# EAGLE design EXT1 (EAGLE 6.4)
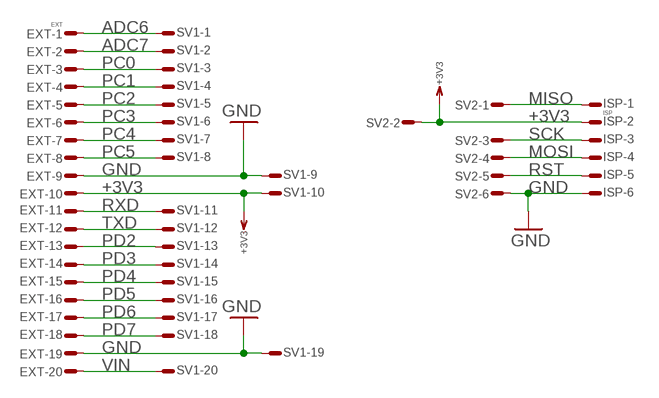
[diagram p0: schematic, sheet 1]

## Parts
EXT  EXT  ML20SE  [ML20S]
ISP  ISP  ML6ES  [ML6S]
SV1  ML20LE  [ML20L]
SV2  ML6EM  [ML6]

## Nets
+3V3: EXT.10 ISP.2 SV1.10 SV2.2
ADC6: EXT.1 SV1.1
ADC7: EXT.2 SV1.2
GND: EXT.9 EXT.19 ISP.6 SV1.9 SV1.19 SV2.6
MISO: ISP.1 SV2.1
MOSI: ISP.4 SV2.4
PC0: EXT.3 SV1.3
PC1: EXT.4 SV1.4
PC2: EXT.5 SV1.5
PC3: EXT.6 SV1.6
PC4: EXT.7 SV1.7
PC5: EXT.8 SV1.8
PD2: EXT.13 SV1.13
PD3: EXT.14 SV1.14
PD4: EXT.15 SV1.15
PD5: EXT.16 SV1.16
PD6: EXT.17 SV1.17
PD7: EXT.18 SV1.18
RST: ISP.5 SV2.5
RXD: EXT.11 SV1.11
SCK: ISP.3 SV2.3
TXD: EXT.12 SV1.12
VIN: EXT.20 SV1.20

## Library data of the parts
EXT SV1 = Conn:ML20?E: HARTING
ISP SV2 = Conn:ML6E: HARTING

## Board
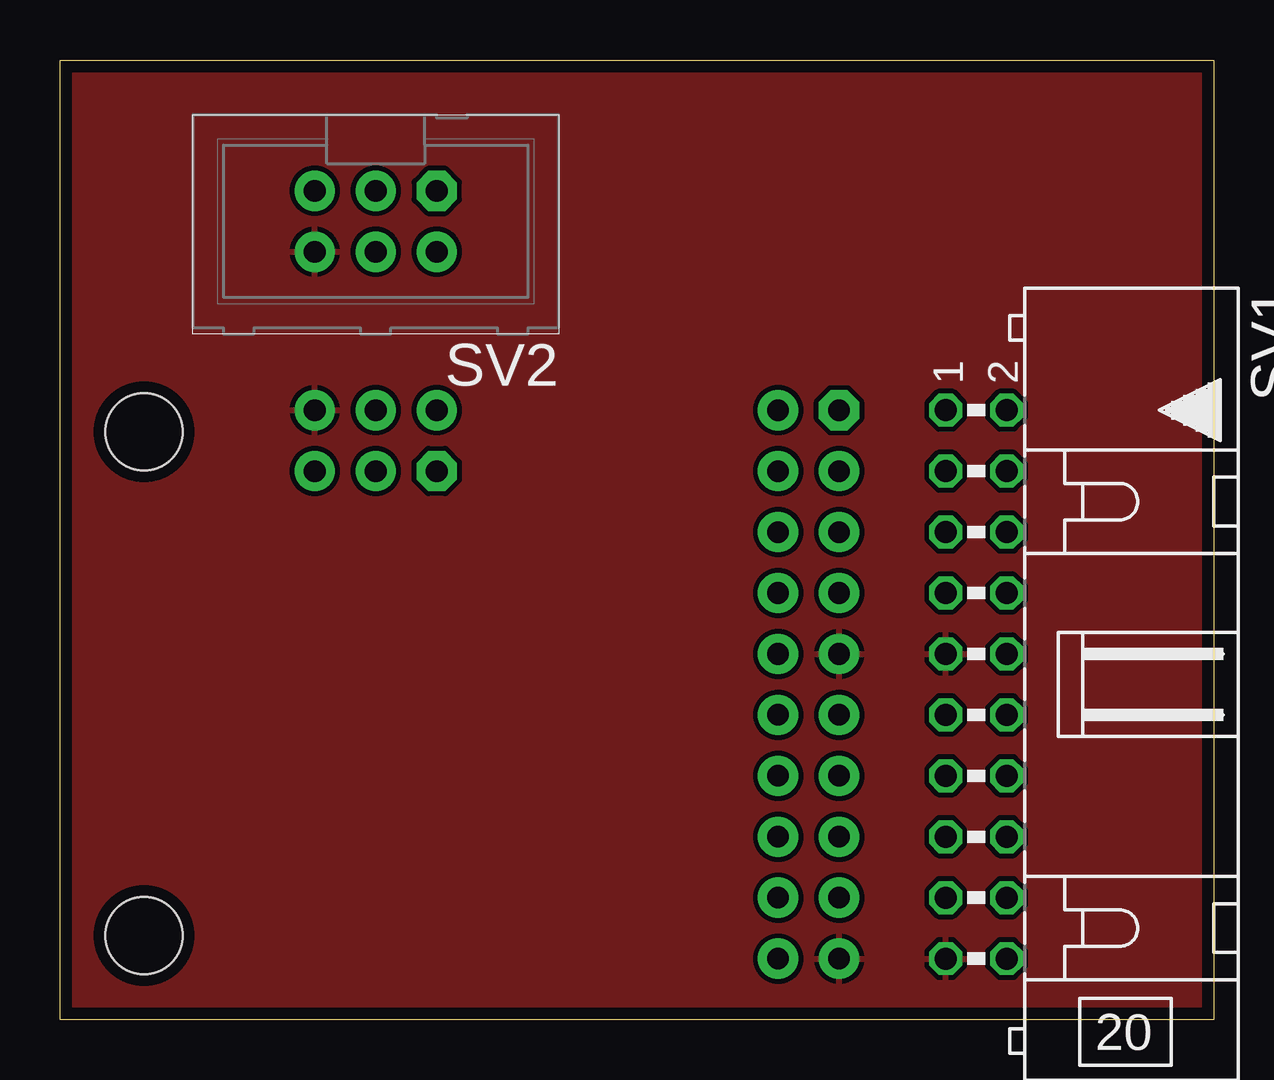
[diagram p1: board, top side]
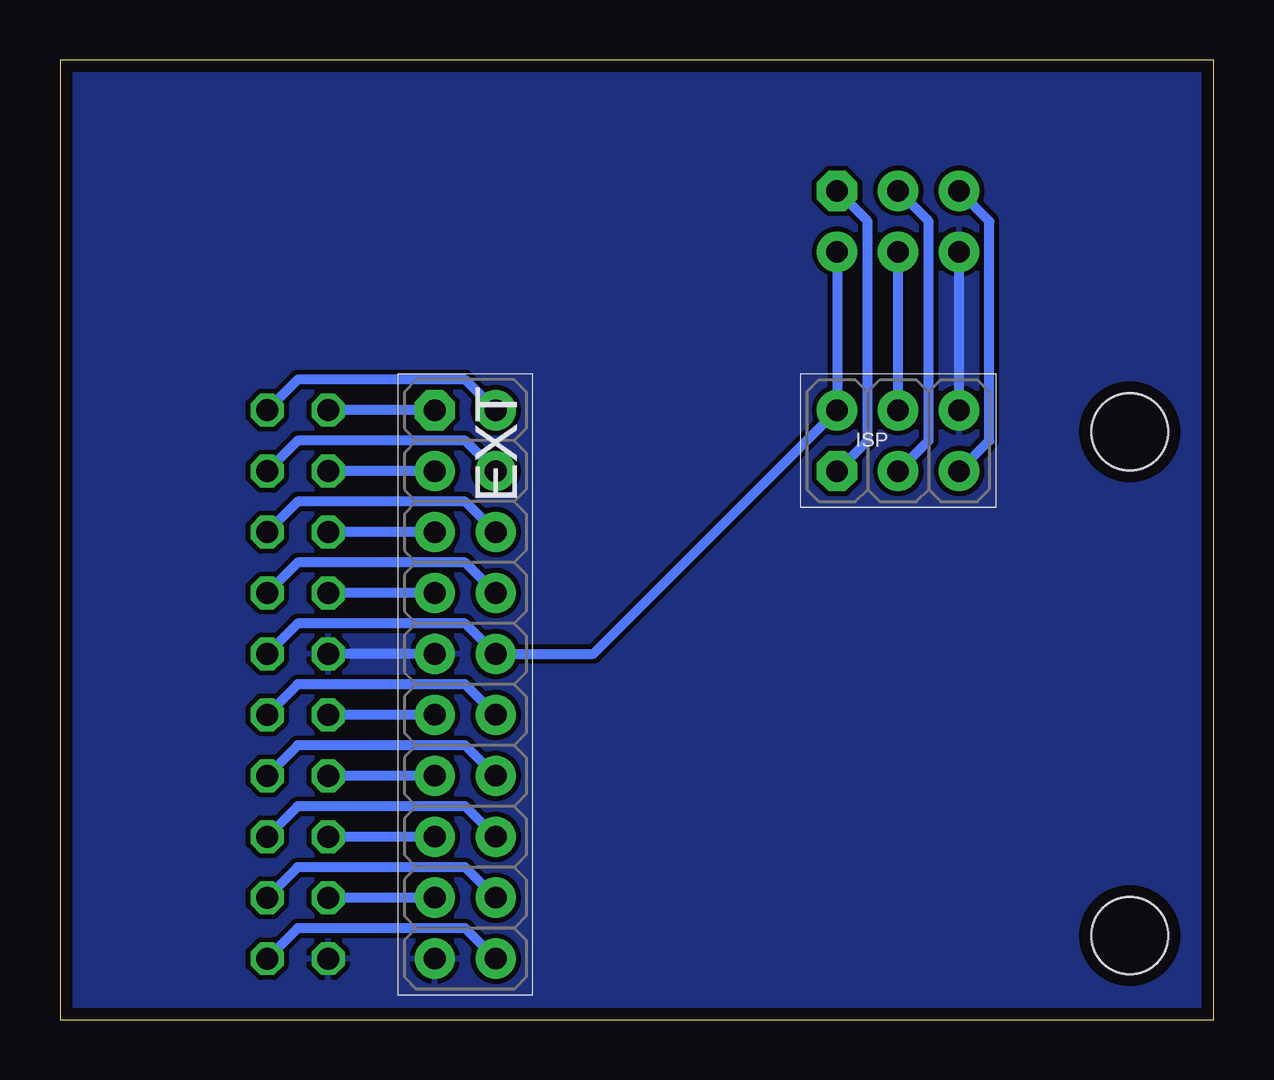
[diagram p2: board, bottom side, seen from below]

Size 48.08 x 40 mm. Coordinates in mm from the lower left corner, seen from the top.
Outline: 48.08,0 0,0 0,40 48.08,40 48.08,0
Copper layers (1*16): Top 0.035mm / dielectric 1.5mm / Bottom 0.035mm
Design rules "default *": minimum track width 10mil, minimum drill 0.4mm, track to track 8mil, track to pad 8mil, pad to pad 8mil, via to via 8mil, smd to smd 8mil, copper to edge 0.5mm, drill to drill 8mil, minimum pad ring 8mil, minimum via ring 8mil, stop-mask expansion 2mil, vias tented up to drill 25mil, thermal gap 8mil
Holes 3.2 mm at 3.5,24.5 3.5,3.5

### Footprints (pad centres in the part's own frame; a part is rotated, then mirrored left to right if it is on the bottom)
ML20S = drill 0.9 pad 1.676 octagon: 1 -11.43,-1.27 | drill 0.9 pad 1.676: 2 -11.43,1.27; 3 -8.89,-1.27; 4 -8.89,1.27; 5 -6.35,-1.27; 6 -6.35,1.27; 7 -3.81,-1.27; 8 -3.81,1.27; 9 -1.27,-1.27; 10 -1.27,1.27; 11 1.27,-1.27; 12 1.27,1.27; 13 3.81,-1.27; 14 3.81,1.27; 15 6.35,-1.27; 16 6.35,1.27; 17 8.89,-1.27; 18 8.89,1.27; 19 11.43,-1.27; 20 11.43,1.27
ML6S = drill 0.9 pad 1.676 octagon: 1 -2.54,-1.27 | drill 0.9 pad 1.676: 2 -2.54,1.27; 3 0,-1.27; 4 0,1.27; 5 2.54,-1.27; 6 2.54,1.27
ML20L = drill 0.914 octagon: 1 -11.43,-1.27; 2 -11.43,1.27; 3 -8.89,-1.27; 4 -8.89,1.27; 5 -6.35,-1.27; 6 -6.35,1.27; 7 -3.81,-1.27; 8 -3.81,1.27; 9 -1.27,-1.27; 10 -1.27,1.27; 11 1.27,-1.27; 12 1.27,1.27; 13 3.81,-1.27; 14 3.81,1.27; 15 6.35,-1.27; 16 6.35,1.27; 17 8.89,-1.27; 18 8.89,1.27; 19 11.43,-1.27; 20 11.43,1.27
ML6 = drill 0.9 pad 1.676 octagon: 1 -2.54,-1.27 | drill 0.9 pad 1.676: 2 -2.54,1.27; 3 0,-1.27; 4 0,1.27; 5 2.54,-1.27; 6 2.54,1.27

### Placement (x,y rotation side)
EXT  31.19,13.97 270 bottom
ISP  13.16,24.13 0 bottom
SV1  38.18,13.97 270 top
SV2  13.16,33.27 180 top

### Tracks (layer width: path | path; a pad name or v marks a point on that pad's centre or on a via)
+3V3
  Bottom 0.406: SV1.10 38.18,16.51 31.19,16.51 EXT.10 25.86,15.24 ISP.2 SV2.2
ADC6
  Bottom 0.406: EXT.1 SV1.1
ADC7
  Bottom 0.406: EXT.2 31.19,26.67 38.18,26.67 SV1.2
GND
  Bottom 0.406: EXT.9 SV1.9 | ISP.6 SV2.6
  pour Bottom: 48.08,0 0,0 0,40 48.08,40
  pour Top: 48.08,0 0,0 0,40 48.08,40
MISO
  Bottom 0.406: ISP.1 14.43,24.13 14.43,33.27 SV2.1
MOSI
  Bottom 0.406: ISP.4 SV2.4
PC0
  Bottom 0.406: EXT.3 SV1.3
PC1
  Bottom 0.406: EXT.4 31.19,24.13 38.18,24.13 SV1.4
PC2
  Bottom 0.406: EXT.5 SV1.5
PC3
  Bottom 0.406: EXT.6 31.19,21.59 38.18,21.59 SV1.6
PC4
  Bottom 0.406: EXT.7 SV1.7
PC5
  Bottom 0.406: EXT.8 31.19,19.05 38.18,19.05 SV1.8
PD2
  Bottom 0.406: EXT.13 SV1.13
PD3
  Bottom 0.406: EXT.14 31.19,11.43 38.18,11.43 SV1.14
PD4
  Bottom 0.406: EXT.15 SV1.15
PD5
  Bottom 0.406: EXT.16 31.19,8.89 38.18,8.89 SV1.16
PD6
  Bottom 0.406: EXT.17 SV1.17
PD7
  Bottom 0.406: EXT.18 31.19,6.35 38.18,6.35 SV1.18
RST
  Bottom 0.406: ISP.5 9.35,24.13 9.35,33.27 SV2.5
RXD
  Bottom 0.406: EXT.11 SV1.11
SCK
  Bottom 0.406: ISP.3 11.89,24.13 11.89,33.27 SV2.3
TXD
  Bottom 0.406: EXT.12 31.19,13.97 38.18,13.97 SV1.12
VIN
  Bottom 0.406: EXT.20 31.19,3.81 38.18,3.81 SV1.20